# Altium schematic sheet DEPRECATED-lvd.SchDoc
size A4; SheetNumber: 6; SheetTotal: 6
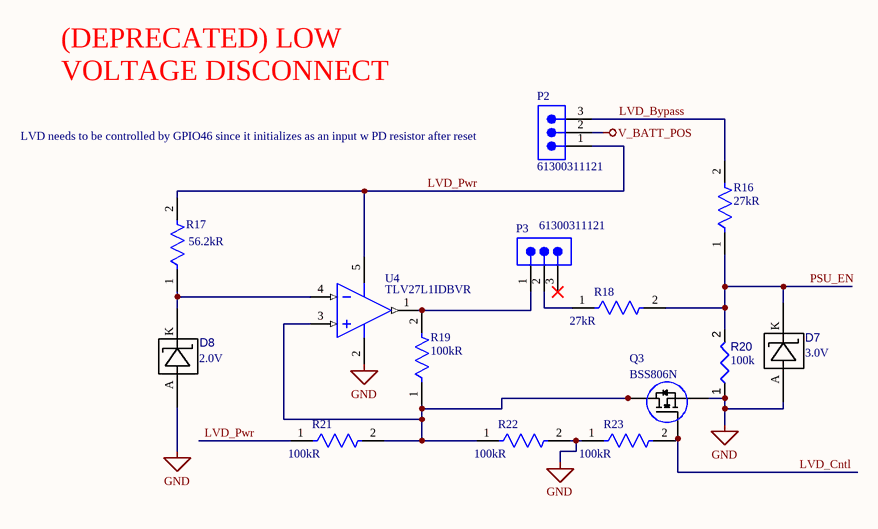
[diagram p0: DEPRECATED-lvd.SchDoc]

## Parts
D7  Nominal Voltage: 3.0V  [SOD523 (SC-79)]  (hidden comment: BZX58550-C3V0-QX)
D8  Nominal Voltage: 2.0V  [SOD523 (SC-79)]  (hidden comment: BZX58550-C2V0-QX)
P2  61300311121  [61300311121]
P3  61300311121  [61300311121]
Q3  BSS806N  [INF-PG-SOT23_M]
R16  Resistance: 27kR  [FP-RMCF0805-IPC_A]  (hidden comment: RMCF0805FT27K0)
R17  Resistance: 56.2kR  [FP-RMCF0805-IPC_A]  (hidden comment: RMCF0805FT56K2)
R18  Resistance: 27kR  [FP-RMCF0805-IPC_A]  (hidden comment: RMCF0805FT27K0)
R19  Resistance: 100kR  [FP-RMCF0805-IPC_C]  (hidden comment: RMCF0805FG100K)
R20  value 100k  [RESC1608X55X25ML10T15]  (hidden comment: Resistor 100k +/-1% 0603 100 mW)
R21  Resistance: 100kR  [FP-RMCF0805-IPC_C]  (hidden comment: RMCF0805FG100K)
R22  Resistance: 100kR  [FP-RMCF0805-IPC_C]  (hidden comment: RMCF0805FG100K)
R23  Resistance: 100kR  [FP-RMCF0805-IPC_C]  (hidden comment: RMCF0805FG100K)
U4  TLV27L1IDBVR  [DBV0005A_L]

## Nets
GND: D7.A D8.A Q3.S R20.1 R22.2 R23.1 U4.2(GND)
V_BATT_POS: P2.2
LVD_Bypass: P2.3 R16.2
LVD_Cntl: Q3.G R23.2
LVD_Pwr: P2.1 R17.2 R21.1 U4.5(VDD)
PSU_EN: D7.K R16.1 R18.2 R20.2
NetD8_K: D8.K R17.1 U4.4(IN-)
NetP3_1: P3.1 R19.2 U4.1(OUT)
NetP3_2: P3.2 R18.1
NetQ3_D: Q3.D R19.1 R21.2 R22.1 U4.3(IN+)

Not connected (* = marked no-connect by the designer): P3 3*

## Notes on the sheet
- (DEPRECATED) LOW VOLTAGE DISCONNECT
- (near P2) LVD needs to be controlled by GPIO46 since it initializes as an input w PD resistor after reset

## Library data of the parts
D7 = CMP-004-00052-1: Diode Zener Single 3V 5% 300mW 2-Pin SOD-523 T/R
D8 = CMP-004-00051-2: Diode Zener Single 2V 5% 300mW 2-Pin SOD-523 T/R
P2 P3 = CMP-002-00111-1: Board Connector, 3 Contact(s), 1 Row(s), Male, Straight, 0.1 inch Pitch, Solder Terminal, Locking, Black Insulator, Plug; Mounting Technology: Board; Min Operating Temperature: -40°C; RoHS Compliant: Yes; Connector Type: BOARD CONNECTOR; Max Operating Temperature: 125°C
Q3 = CMP-013-00036-2: Small Signal Field-Effect Transistor, 2.3A I(D), 20V, 1-Element, N-Channel, Silicon, Metal-oxide Semiconductor FET; Pins: 3; RoHS Compliant: Yes
R16 R18 = CMP-26527-006833-1: 27kΩ ±1% 0.125W 0805 Thick Film Chip Resistor AEC-Q200 compliant; Max Power Dissipation: 125mW; Temperature Coefficient: 100ppm/°C; Width: 0.049inch; Length: 0.079inch; Case/Package: 0805; Case Code (Imperial): 0805; Tolerance: 1%; Min Operating Temperature: -55°C; RoHS Compliant: Yes; Packaging: Tape and Reel; Mount: Surface Mount; Height: 0.026inch; Radiation Hardening: No; Series: RMCF; Contact Plating: Tin; Number of Terminations: 2; Case Code (Metric): 2012; Lead Free: Lead Free; Features: Automotive AEC-Q200; Max Operating Temperature: 155°C; Resistor Type: Thick Film
R17 = CMP-26527-000649-1: 56.2kΩ ±1% 0.125W 0805 Thick Film Chip Resistor AEC-Q200 compliant; Power Rating: 125mW; Temperature Coefficient: 100ppm/°C; Case Code (Metric): 2012; Case/Package: 0805; Radiation Hardening: No; Number of Terminations: 2; Military Standard: Not; Mount: Surface Mount; Lead Free: Lead Free; Height: 0.026inch; RoHS Compliant: Yes; Resistor Type: Thick Film; Contact Plating: Tin; Min Operating Temperature: -55°C; Max Operating Temperature: 155°C; Tolerance: 1%; Length: 0.079inch; Construction: Rectangular; Features: Automotive AEC-Q200; Packaging: Tape and Reel; Size Code: 0805; Width: 0.049inch; Max Power Dissipation: 125mW; Depth: 1.25mm; Series: RMCF; Case Code (Imperial): 0805
R19 R21-R23 = CMP-26527-003818-1: 100kΩ ±1% 0.125W 0805 Thick Film Chip Resistor AEC-Q200 compliant; Temperature Coefficient: 100ppm/°C; Max Power Dissipation: 125mW; Case Code (Metric): 2012; Width: 0.049inch; Min Operating Temperature: -55°C; Features: Automotive AEC-Q200; Contact Plating: Tin; Radiation Hardening: No; Construction: Rectangular; RoHS Compliant: Yes; Package Quantity: 10000; Resistor Type: Thick Film; Military Standard: Not; Series: RMCF; Number of Terminations: 2; Height: 0.026inch; Max Operating Temperature: 155°C; Case/Package: 0805; Case Code (Imperial): 0805; Tolerance: 1%; Packaging: Tape and Reel; Depth: 1.25mm; Mount: Surface Mount; Length: 0.079inch
R20 = CMP-009-00023-5: Chip Resistor, 100 KOhm, +/- 1%, 0.1 W, -55 to 155 degC, 0603 (1608 Metric); Voltage Rating: 50V; Power: 100mW; Max Operating Temperature: 155°C; RoHS Compliant: True; Tolerance: 1%; Pins: 2; Case/Package: 0603; Mounting Technology: SM; Min Operating Temperature: -55°C
U4 = CMP-0272-03334-3: 11 uA/Ch, 160 kHz, RR-Out Operational Amplifier, 2.7 to 16 V, -40 to 125 degC, 5-pin SOT23 (DBV5), Green (RoHS & no Sb/Br); Manufacturer: Texas Instruments; Sub Family: Low Power Amp (<=500uA), Low Supply Voltage Amplifier (<=2.7V), Precision Amplifier; Total Supply Voltage(Max)(+5V is 5, +/-5V is 10): 16; Slew Rate(Typ)(V/us): 0.06; Iq per channel(Max)(mA): 0.011; GBW(Typ)(MHz): 0.18; Rating: Catalog; Number of Channels: 1; IIB(Max)(pA): 60; Total Supply Voltage(Min)(+5V is 5, +/-5V is 10): 2.7; Packing: LARGE T&R; CMRR(Min)(dB): 71; Offset Drift(Typ)(uV/C): 1.1; Vio (25C)(Max)(mV): 5; Code_JEDEC: MO-178; ComponentLink1URL: http://www.ti.com/; PackageVersion: 4073253-4/K, 03/2006; ComponentLink2Description: Datasheet; DatasheetVersion: SLOS378B; PackageReference: DBV0005A; ComponentLink3Description: Package Specification; ComponentLink3URL: http://www.ti.com/litv/pdf/mpds018i; Eco-Plan: Green (RoHS & no Sb/Br); PartNumber: TLV27L1IDBVR; ComponentLink2URL: http://www.ti.com/lit/ds/symlink/tlv27l1.pdf; ComponentLink1Description: Manufacturer URL; Mounting Technology: Surface Mount; PackageDescription: 5-Pin Plastic Small Outline, Body 1.6 x 2.9 mm, Pitch 0.95 mm